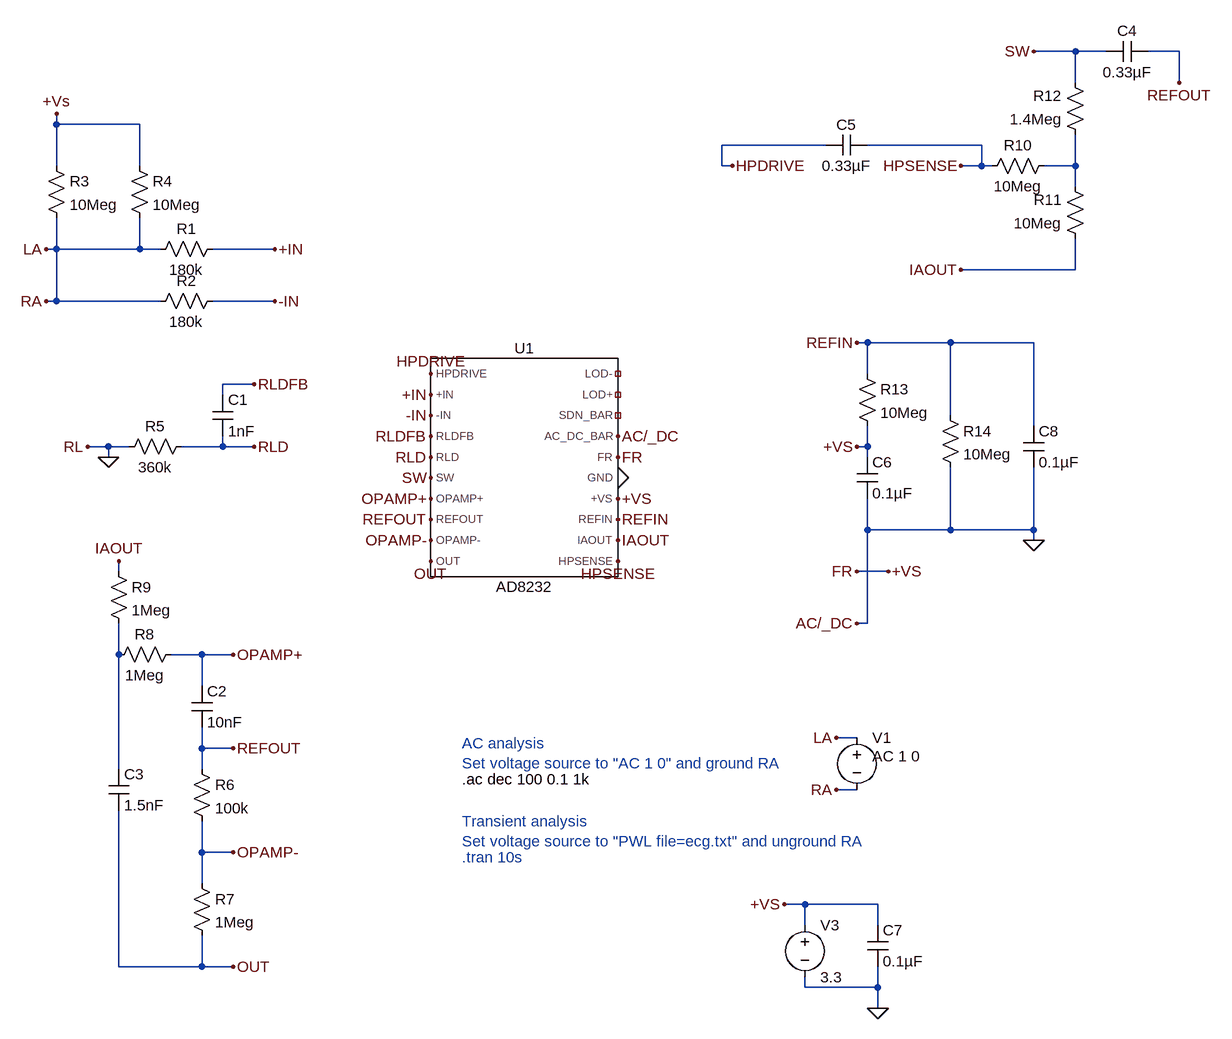
[diagram p0: schematic ecg_monitor_2.asc]
ecg_monitor_2.asc, the LTspice schematic file:
Version 4
SHEET 1 2156 1116
WIRE 1072 -512 1008 -512
WIRE 1120 -512 1072 -512
WIRE 1232 -512 1184 -512
WIRE 1072 -464 1072 -512
WIRE 1232 -464 1232 -512
WIRE -496 -400 -496 -416
WIRE -368 -400 -496 -400
WIRE 688 -368 528 -368
WIRE 928 -368 752 -368
WIRE -496 -336 -496 -400
WIRE -368 -336 -368 -400
WIRE 528 -336 528 -368
WIRE 544 -336 528 -336
WIRE 928 -336 928 -368
WIRE 928 -336 896 -336
WIRE 944 -336 928 -336
WIRE 1072 -336 1072 -384
WIRE 1072 -336 1024 -336
WIRE 1072 -304 1072 -336
WIRE -496 -208 -496 -256
WIRE -496 -208 -512 -208
WIRE -368 -208 -368 -256
WIRE -368 -208 -496 -208
WIRE -336 -208 -368 -208
WIRE -160 -208 -256 -208
WIRE 1072 -176 1072 -224
WIRE 1072 -176 896 -176
WIRE -496 -128 -496 -208
WIRE -496 -128 -512 -128
WIRE -336 -128 -496 -128
WIRE -160 -128 -256 -128
WIRE 752 -64 736 -64
WIRE 880 -64 752 -64
WIRE 1008 -64 880 -64
WIRE 752 -16 752 -64
WIRE -192 0 -240 0
WIRE -240 16 -240 0
WIRE 880 48 880 -64
WIRE 1008 64 1008 -64
WIRE -416 96 -448 96
WIRE -384 96 -416 96
WIRE -240 96 -240 80
WIRE -240 96 -304 96
WIRE -192 96 -240 96
WIRE 752 96 752 64
WIRE 752 96 736 96
WIRE -416 112 -416 96
WIRE 752 112 752 96
WIRE 752 224 752 176
WIRE 880 224 880 128
WIRE 880 224 752 224
WIRE 1008 224 1008 128
WIRE 1008 224 880 224
WIRE 1008 240 1008 224
WIRE -400 288 -400 272
WIRE 784 288 736 288
WIRE 752 368 752 224
WIRE 752 368 736 368
WIRE -400 416 -400 368
WIRE -272 416 -320 416
WIRE -224 416 -272 416
WIRE -272 464 -272 416
WIRE 736 544 704 544
WIRE -272 560 -272 528
WIRE -224 560 -272 560
WIRE -400 592 -400 416
WIRE -272 592 -272 560
WIRE 736 624 704 624
WIRE -272 720 -272 672
WIRE -224 720 -272 720
WIRE -272 768 -272 720
WIRE 656 800 624 800
WIRE 768 800 656 800
WIRE 656 832 656 800
WIRE 768 832 768 800
WIRE -400 896 -400 656
WIRE -272 896 -272 848
WIRE -272 896 -400 896
WIRE -224 896 -272 896
WIRE 656 928 656 912
WIRE 768 928 768 896
WIRE 768 928 656 928
WIRE 768 960 768 928
FLAG 704 544 LA
FLAG 704 624 RA
FLAG 624 800 +VS
FLAG 768 960 0
FLAG 80 -16 HPDRIVE
FLAG 80 16 +IN
FLAG 80 48 -IN
FLAG 80 80 RLDFB
FLAG 80 144 SW
FLAG 80 112 RLD
FLAG 80 176 OPAMP+
FLAG 80 208 REFOUT
FLAG 80 240 OPAMP-
FLAG 80 272 OUT
FLAG 368 80 AC/_DC
FLAG 368 112 FR
FLAG 368 176 +VS
FLAG 368 208 REFIN
FLAG 368 240 IAOUT
FLAG 368 272 HPSENSE
FLAG -496 -416 +Vs
FLAG -512 -208 LA
FLAG -512 -128 RA
FLAG -160 -208 +IN
FLAG -160 -128 -IN
FLAG -192 0 RLDFB
FLAG -192 96 RLD
FLAG -448 96 RL
FLAG -400 272 IAOUT
FLAG -224 416 OPAMP+
FLAG -224 560 REFOUT
FLAG -224 720 OPAMP-
FLAG -224 896 OUT
FLAG 1232 -464 REFOUT
FLAG 896 -176 IAOUT
FLAG 896 -336 HPSENSE
FLAG 544 -336 HPDRIVE
FLAG 1008 240 0
FLAG 368 144 0
FLAG 736 96 +VS
FLAG 736 -64 REFIN
FLAG 736 368 AC/_DC
FLAG 784 288 +VS
FLAG 736 288 FR
FLAG 1008 -512 SW
FLAG -416 112 0
SYMBOL AD8232 224 128 R0
SYMATTR InstName U1
SYMBOL voltage 736 528 R0
WINDOW 123 24 44 Left 2
WINDOW 39 0 0 Left 0
WINDOW 3 24 44 Left 2
SYMATTR Value2 AC 1 0
SYMATTR Value ""
SYMATTR InstName V1
SYMBOL voltage 656 816 R0
SYMATTR InstName V3
SYMATTR Value 3.3
SYMBOL cap 752 832 R0
SYMATTR InstName C7
SYMATTR Value 0.1µF
SYMBOL res -240 -224 R90
WINDOW 0 0 56 VBottom 2
WINDOW 3 32 56 VTop 2
SYMATTR InstName R1
SYMATTR Value 180k
SYMBOL res -240 -144 R90
WINDOW 0 0 56 VBottom 2
WINDOW 3 32 56 VTop 2
SYMATTR InstName R2
SYMATTR Value 180k
SYMBOL res -512 -352 R0
SYMATTR InstName R3
SYMATTR Value 10Meg
SYMBOL res -384 -352 R0
SYMATTR InstName R4
SYMATTR Value 10Meg
SYMBOL cap -256 16 R0
SYMATTR InstName C1
SYMATTR Value 1nF
SYMBOL res -288 80 R90
WINDOW 0 0 56 VBottom 2
WINDOW 3 32 56 VTop 2
SYMATTR InstName R5
SYMATTR Value 360k
SYMBOL cap -288 464 R0
SYMATTR InstName C2
SYMATTR Value 10nF
SYMBOL res -288 576 R0
SYMATTR InstName R6
SYMATTR Value 100k
SYMBOL res -288 752 R0
SYMATTR InstName R7
SYMATTR Value 1Meg
SYMBOL res -304 400 R90
WINDOW 0 0 56 VBottom 2
WINDOW 3 32 56 VTop 2
SYMATTR InstName R8
SYMATTR Value 1Meg
SYMBOL res -416 272 R0
SYMATTR InstName R9
SYMATTR Value 1Meg
SYMBOL cap -416 592 R0
SYMATTR InstName C3
SYMATTR Value 1.5nF
SYMBOL res 1040 -352 R90
WINDOW 0 0 56 VBottom 2
WINDOW 3 32 56 VTop 2
SYMATTR InstName R10
SYMATTR Value 10Meg
SYMBOL res 1088 -208 R180
WINDOW 0 36 76 Left 2
WINDOW 3 36 40 Left 2
SYMATTR InstName R11
SYMATTR Value 10Meg
SYMBOL res 1088 -368 R180
WINDOW 0 36 76 Left 2
WINDOW 3 36 40 Left 2
SYMATTR InstName R12
SYMATTR Value 1.4Meg
SYMBOL cap 1184 -528 R90
WINDOW 0 0 32 VBottom 2
WINDOW 3 32 32 VTop 2
SYMATTR InstName C4
SYMATTR Value 0.33µF
SYMBOL cap 752 -384 R90
WINDOW 0 0 32 VBottom 2
WINDOW 3 32 32 VTop 2
SYMATTR InstName C5
SYMATTR Value 0.33µF
SYMBOL res 736 -32 R0
SYMATTR InstName R13
SYMATTR Value 10Meg
SYMBOL cap 736 112 R0
SYMATTR InstName C6
SYMATTR Value 0.1µF
SYMBOL res 864 32 R0
SYMATTR InstName R14
SYMATTR Value 10Meg
SYMBOL cap 992 64 R0
SYMATTR InstName C8
SYMATTR Value 0.1µF
TEXT 128 672 Left 2 ;Transient analysis\nSet voltage source to "PWL file=ecg.txt" and unground RA
TEXT 128 728 Left 2 ;.tran 10s
TEXT 128 608 Left 2 !.ac dec 100 0.1 1k
TEXT 128 552 Left 2 ;AC analysis\nSet voltage source to "AC 1 0" and ground RA

The netlist it stands for:
* ecg_monitor_2.asc
XU1 HPDRIVE +IN -IN RLDFB RLD SW OPAMP+ REFOUT OPAMP- OUT NC_01 NC_02 NC_03 0 FR 0 FR REFIN IAOUT HPSENSE AD8232  ; pins HPDRIVE +IN -IN RLDFB RLD SW OPAMP+ REFOUT OPAMP- OUT LOD- LOD+ SDN_BAR AC_DC_BAR FR GND +VS REFIN IAOUT HPSENSE
V1 RA RA AC 1 0
V3 FR 0 3.3
C7 FR 0 0.1µF
R1 +IN RA 180k
R2 -IN RA 180k
R3 FR RA 10Meg
R4 FR RA 10Meg
C1 RLDFB RLD 1nF
R5 RLD 0 360k
C2 OPAMP+ REFOUT 10nF
R6 REFOUT OPAMP- 100k
R7 OPAMP- OUT 1Meg
R8 OPAMP+ N002 1Meg
R9 IAOUT N002 1Meg
C3 N002 OUT 1.5nF
R10 N001 HPSENSE 10Meg
R11 IAOUT N001 10Meg
R12 N001 SW 1.4Meg
C4 REFOUT SW 0.33µF
C5 HPSENSE HPDRIVE 0.33µF
R13 REFIN FR 10Meg
C6 FR 0 0.1µF
R14 REFIN 0 10Meg
C8 REFIN 0 0.1µF
* Transient analysis
* Set voltage source to "PWL file=ecg.txt" and unground RA
* .tran 10s
.ac dec 100 0.1 1k
* AC analysis
* Set voltage source to "AC 1 0" and ground RA
.lib AD8232.cir
.backanno
.end